# EAGLE design ARboard (EAGLE 9.5.2)
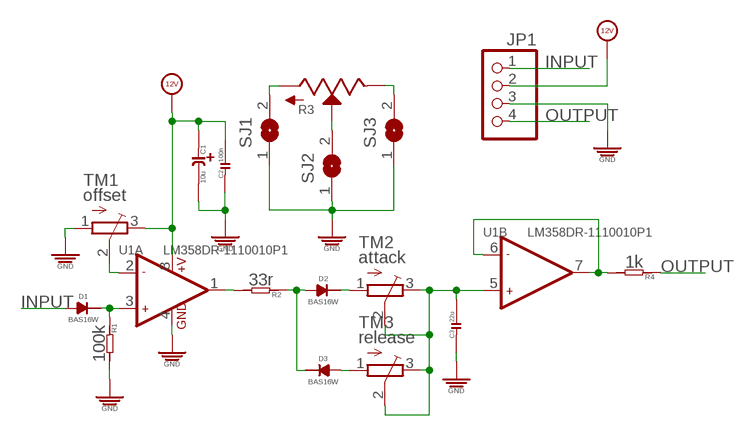
[diagram p0: schematic, sheet 1]

## Parts
C1  10u  C-POLAR-A  [CASE-A_3216]
C2  100n  C-0603  [C0603]
C3  22u  C-0603  [C0603]
D1  BAS16W  [SOT-323]
D2  BAS16W  [SOT-323]
D3  BAS16W  [SOT-323]
JP1  PINHD-1X4  [1X04]
R1  100k  R-0603  [R0603]
R2  33r  R-0603  [R0603]
R3  POTSQUAREHOLE_SMALLKNOB  [ALPS_POT_SQUAREHOLES]
R4  1k  R-0603  [R0603]
SJ1  SJ  [SJ]
SJ2  SJ  [SJ]
SJ3  SJ  [SJ]
TM1  offset  TRIMPOTTC33X  [TC33X]
TM2  attack  TRIMPOTTC33X  [TC33X]
TM3  release  TRIMPOTTC33X  [TC33X]
U1  LM358DR-1110010P1  [SOIC8]

## Nets
12V [power]: C1.+ C2.2 JP1.2 TM1.3(E) U1.8(A:+V)
GND [power]: C1.- C2.1 C3.1 JP1.3 R1.2 SJ1.1 SJ2.1 SJ3.1 TM1.1(A) U1.4(A:GND)
INPUT: D1.ANODE JP1.1
N$1: R3.P$3(A) SJ1.2
N$2: D2.ANODE D3.CATHODE R2.1
N$3: D3.ANODE TM3.1(A)
N$4: D2.CATHODE TM2.1(A)
N$5: R2.2 U1.1(A:OUT1)
N$6: TM1.2(S) U1.2(A:-IN1)
N$7: D1.CATHODE R1.1 U1.3(A:+IN1)
N$9: C3.2 TM2.2(S) TM2.3(E) TM3.2(S) TM3.3(E) U1.5(B:+IN2)
N$10: R4.2 U1.6(B:-IN2) U1.7(B:OUT2)
N$13: R3.P$2(S) SJ2.2
N$14: R3.P$1(E) SJ3.2
OUTPUT: JP1.4 R4.1

## Library data of the parts
C1 = EurorackModularParts:C-POLAR*
C2 C3 = OPL:C*
D1-D3 = FenixBase:BAS16W
JP1 = pinhead:PINHD-1X4: PIN HEADER
R1 R2 R4 = OPL:R*
R3 = EurorackModularParts:POT
SJ1-SJ3 = jumper:SJ: SMD solder JUMPER
TM1-TM3 = adafruit:TRIMPOT: SMT trimmer potentiometer part number TC33X http://www.ladyada.net/library/eagle
U1 = OPL:LM358DR: General purpose LOW Voltage, Rail-to-Rail Output Amplifiers http://www.fairchildsemi.com/ds/LM/LMV358.pdf

## Net classes
0 default: width 0.254 mm
1 power: width 0.305 mm

## Board
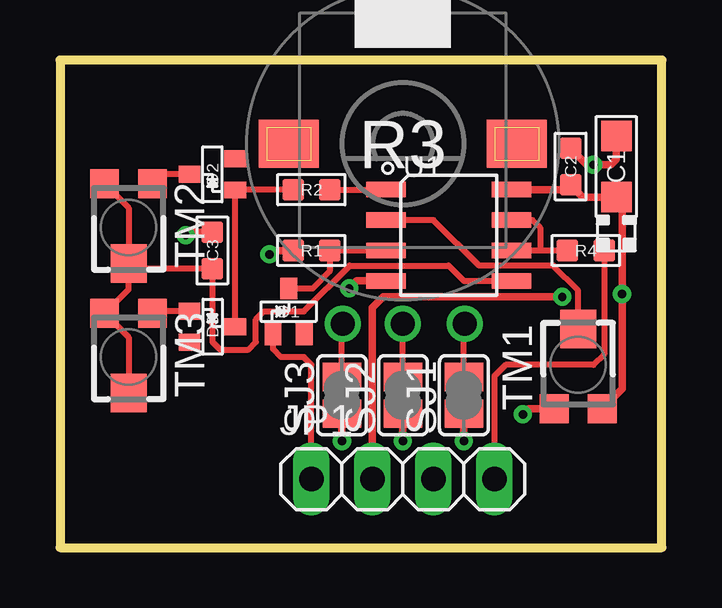
[diagram p1: board, top side]
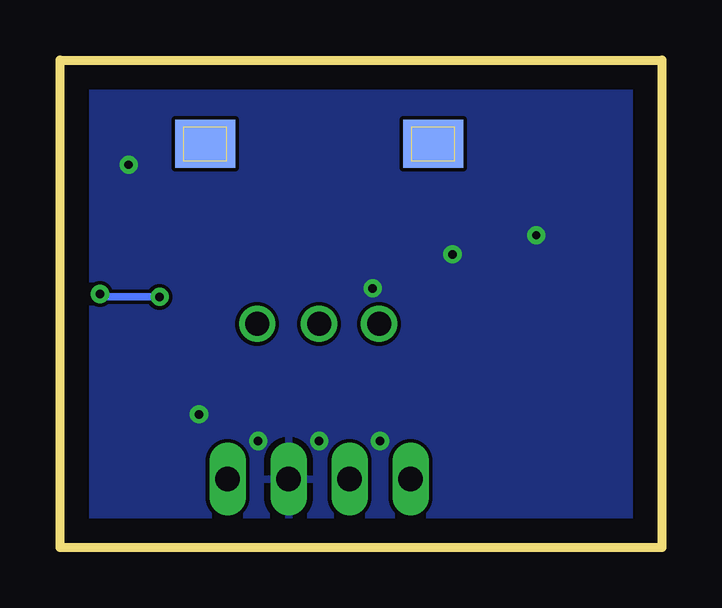
[diagram p2: board, bottom side, seen from below]

Size 25.08 x 20.32 mm. Coordinates in mm from the lower left corner, seen from the top.
Outline: 0,0 25.08,0 25.08,20.32 0,20.32 0,0
Copper layers (1*16): Top 0.035mm / dielectric 1.5mm / Bottom 0.035mm
Design rules "default": minimum track width 6mil, minimum drill 0.35mm, track to track 6mil, track to pad 6mil, pad to pad 6mil, via to via 6mil, smd to smd 6mil, copper to edge 40mil, drill to drill 6mil, minimum pad ring 10mil, minimum via ring 8mil, stop-mask expansion 4mil, vias tented up to drill 0mil, thermal gap 10mil

### Footprints (pad centres in the part's own frame; a part is rotated, then mirrored left to right if it is on the bottom)
CASE-A_3216 = smd 1.27 x 1.27: + -1.27,0; - 1.27,0
C0603 = smd 0.889 x 0.889: 1 -0.762,0; 2 0.762,0
SOT-323 = smd 0.7 x 0.9: ANODE -0.65,-0.95; CATHODE 0,0.95; NC 0.65,-0.95
1X04 = drill 1.016 long: 1 -3.81,0; 2 -1.27,0; 3 1.27,0; 4 3.81,0
R0603 = smd 0.889 x 0.889: 1 -0.762,0; 2 0.762,0
ALPS_POT_SQUAREHOLES = drill 1: P$1 -2.5,-7.5; P$2 0,-7.5; P$3 2.58,-7.5 | smd 2.5 x 2: P$4 -4.75,0; P$5 4.75,0 | smd 2.5 x 2 bottom: P$6 -4.75,0; P$7 4.75,0
SJ = smd 1.168 x 1.6: 1 -0.762,0; 2 0.762,0
TC33X = smd 1.2 x 1.2: 1 -1,-1.825; 3 1,-1.825 | smd 1.5 x 1.6: 2 0,1.5
SOIC8 = smd 1.651 x 0.635: 1 -2.616,1.905; 2 -2.616,0.635; 3 -2.616,-0.635; 4 -2.616,-1.905; 5 2.616,-1.905; 6 2.616,-0.635; 7 2.616,0.635; 8 2.616,1.905

### Placement (x,y rotation side)
C1  23.18,15.88 90 top
C2  21.27,15.88 270 top
C3  6.35,12.38 270 top
D1  9.53,9.84 0 top
D2  6.35,15.56 90 top
D3  6.35,9.21 270 top
JP1  14.29,2.86 0 top
R1  10.48,12.38 180 top
R2  10.48,14.92 0 top
R3  14.29,16.83 0 top
R4  21.91,12.38 180 top
SJ1  16.83,6.35 90 top
SJ2  14.29,6.35 90 top
SJ3  11.75,6.35 90 top
TM1  21.59,7.62 0 top
TM2  2.86,13.34 180 top
TM3  2.86,7.94 180 top
U1  16.19,13.02 0 top

### Tracks (layer width: path | path; a pad name or v marks a point on that pad's centre or on a via)
12V  (via drill 0.35)
  Top 0.305: U1.8 21.08,14.92 C2.2 21.78,14.61 C1.+ 23.42,14.36 v23.42,10.57 23.42,6.62 TM1.3 | JP1.2 13.02,10 13.47,10.45 v20.93,10.45
  Bottom 0.305: v23.42,10.57 23.3,10.45 v20.93,10.45
GND  (via drill 0.35)
  Top 0.305: SJ3.1 v11.75,4.45 | SJ2.1 v14.29,4.45 | SJ1.1 v16.83,4.45 | 21.27,16.83 C2.1 21.95,15.95 v22.23,15.95 22.94,15.95 23.18,16.19 C1.- | C1.- 23.02,17.3 | R1.2 8.89,12.38 v8.73,12.22 | C1.- 22.97,17.35 | C3.1 5.37,13.14 v5.24,13.02 | U1.4 12.36,11.11 v12.05,10.81 | TM1.1 19.53,5.79 v19.29,5.56
  pour Bottom: 0,21.67 0,0 25.08,0 25.08,21.67
INPUT
  Top 0.254: D1.ANODE 8.88,8.27 9.21,7.94 10.16,7.94 10.48,7.62 JP1.1
N$1
  Top 0.254: SJ1.2 16.83,9.29 R3.P$3
N$2
  Top 0.254: R2.1 9.7,14.91 D2.ANODE D3.CATHODE
N$3
  Top 0.254: D3.ANODE 3.95,9.86 TM3.1
N$4
  Top 0.254: D2.CATHODE 4.25,15.56 TM2.1
N$5
  Top 0.254: R2.2 U1.1
N$6
  Top 0.254: U1.2 15.56,13.65 17.46,11.75 20.56,11.75 21.59,10.72 TM1.2
N$7
  Top 0.254: U1.3 R1.1 11.24,11.51 10.52,10.79 D1.CATHODE
N$9
  Top 0.254: TM2.3 2.86,14.16 TM2.2 | TM2.2 2.86,10.76 TM3.3 2.86,8.76 TM3.2 | TM2.2 3.07,11.62 C3.2 6.35,8.57 6.67,8.26 7.85,8.26 8.17,8.57 8.17,9.52 8.49,9.84 10.16,9.84 12.06,11.75 16.19,11.75 16.83,11.11 U1.5
N$10
  Top 0.254: R4.2 20,12.38 | 20,12.38 U1.6 | U1.7 19.68,13.65 20,13.34 20,12.38
N$13
  Top 0.254: SJ2.2 R3.P$2
N$14
  Top 0.254: SJ3.2 11.75,9.29 R3.P$1
OUTPUT
  Top 0.254: R4.1 22.67,8.06 22.23,7.62 18.57,7.62 18.1,7.14 JP1.4

### Text on the board
Document: Att | Rel | Com | in | + | - | out